# Altium schematic sheet CAN.SchDoc
size A4; SheetNumber: 4; SheetTotal: 5
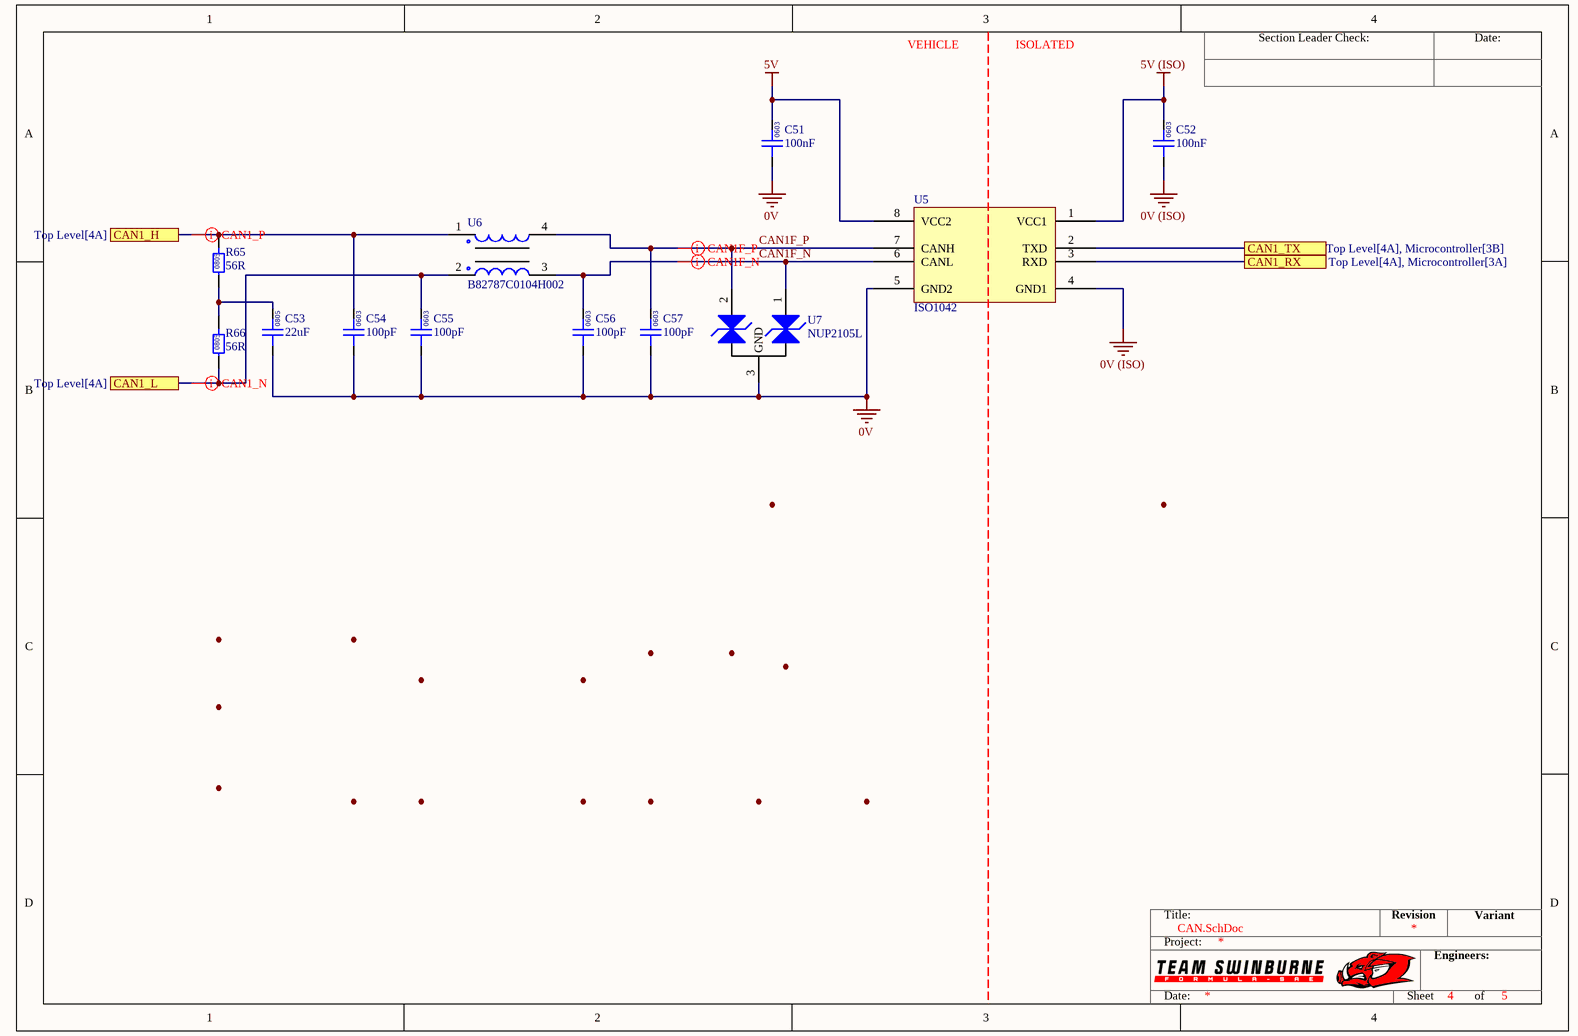
[diagram p0: CAN.SchDoc]

## Parts
C51  100nF  [0603]
C52  100nF  [0603]
C53  22uF  [0805]
C54  100pF  [0603]
C55  100pF  [0603]
C56  100pF  [0603]
C57  100pF  [0603]
R65  56R  [0805]
R66  56R  [0805]
U5  ISO1042  [TI-SOIC-8]
U6  B82787C0104H002  [TDK 4-PC Pad]
U7  NUP2105L  [ON SOT-23]

## Ports
CAN1_H (see Top Level[4A]), CAN1_L (see Top Level[4A]), CAN1_RX (see Top Level[4A], Microcontroller[3A]), CAN1_TX (see Top Level[4A], Microcontroller[3B])

## Nets
0V: C51.1 C53.1 C54.1 C55.1 C56.1 C57.1 U5.5(GND2) U7.3(GND)
0V (ISO): C52.1 U5.4(GND1)
5V: C51.2 U5.8(VCC2)
5V (ISO): C52.2 U5.1(VCC1)
CAN1_H: C54.2 R65.2 U6.1 ; port CAN1_H
CAN1_L: C55.2 R66.1 U6.2 ; port CAN1_L
CAN1_RX: U5.3(RXD) ; port CAN1_RX
CAN1_TX: U5.2(TXD) ; port CAN1_TX
CAN1F_N: C56.2 U5.6(CANL) U6.3 U7.1(CAN_H)
CAN1F_P: C57.2 U5.7(CANH) U6.4 U7.2(CAN_L)
NetC53_2: C53.2 R65.1 R66.2

## Layout directives
differential pair: CAN1_H, CAN1_L, CAN1F_N, CAN1F_P

## Notes on the sheet
- VEHICLE
- ISOLATED
- Section Leader Check:
- Date:
- Title:
- Revision
- Variant
- Project:
- Engineers:
- Sheet
- of
- (in symbol GCM188L81H104KA57D) 0603
- (in symbol GRM21BR61A226ME51L) 0805
- (in symbol GRM1885C1H101JA01D) 0603
- (in symbol RC0805FR0756RL) 0805

## Library data of the parts
C51 C52 = GCM188L81H104KA57D: Manufacturer: muRata; Rated Voltage: 50V; Tolerance: ±10%; Material: MLCC; Temperature Rating: X8L; Part Number: GCM188L81H104KA57D; Value: 100nF; Digikey Part Number: 490-6049-1-ND
C53 = GRM21BR61A226ME51L: Manufacturer: muRata; Rated Voltage: 10V; Tolerance: 20%; Material: MLCC; Temperature Rating: X5R; Part Number: GRM21BR61A226ME51L; Value: 22uF; Digikey Part Number: 490-10511-1-ND
C54-C57 = GRM1885C1H101JA01D: Manufacturer: Murata Electronics; Rated Voltage: 50V; Tolerance: ±5%; Material: MLCC; Temperature Rating: C0G, NP0; Part Number: GRM1885C1H101JA01D; Value: 100pF; Digikey Part Number: 490-1427-1-ND
R65 R66 = RC0805FR0756RL: Manufacturer: YAGEO; Tolerance: 0.01; Rated Power: 0.125W; Part Number: RC0805FR0756RL; Value: 56R; Material: FR-07; Digikey Part Number: 311-56.0CRCT-ND
U5 = ISO1042: IC CAN TRANSCEIVER 1/1 8SOIC; Manufacturer: Texas Instruments; Part Number: ISO1042; Digikey Part Number: 296-ISO1042BQDWVQ1-ND
U6 = B82787C0104H002: Manufacturer: EPCOS (TDK); Value: 100µH @ 100kHz; Impedance: 5.8 kOhms @ 10MHz; Rated Current: 150mA; Part Number: B82787C0104H002; Material: Wirewound; Digikey Part Number: 495-4598-1-ND
U7 = NUP2105L: Dual Line CAN Bus Protector; Manufacturer: ON Semiconductor; Part Number: NUP2105L; Digikey Part Number: NUP2105LT1GOSCT-ND; Digikey Link: https://www.digikey.com/product-detail/en/on-semiconductor/NUP2105LT1G/NUP2105LT1GOSCT-ND/1485001